# EAGLE design IA + Asserv Shield (EAGLE 9.3.0)
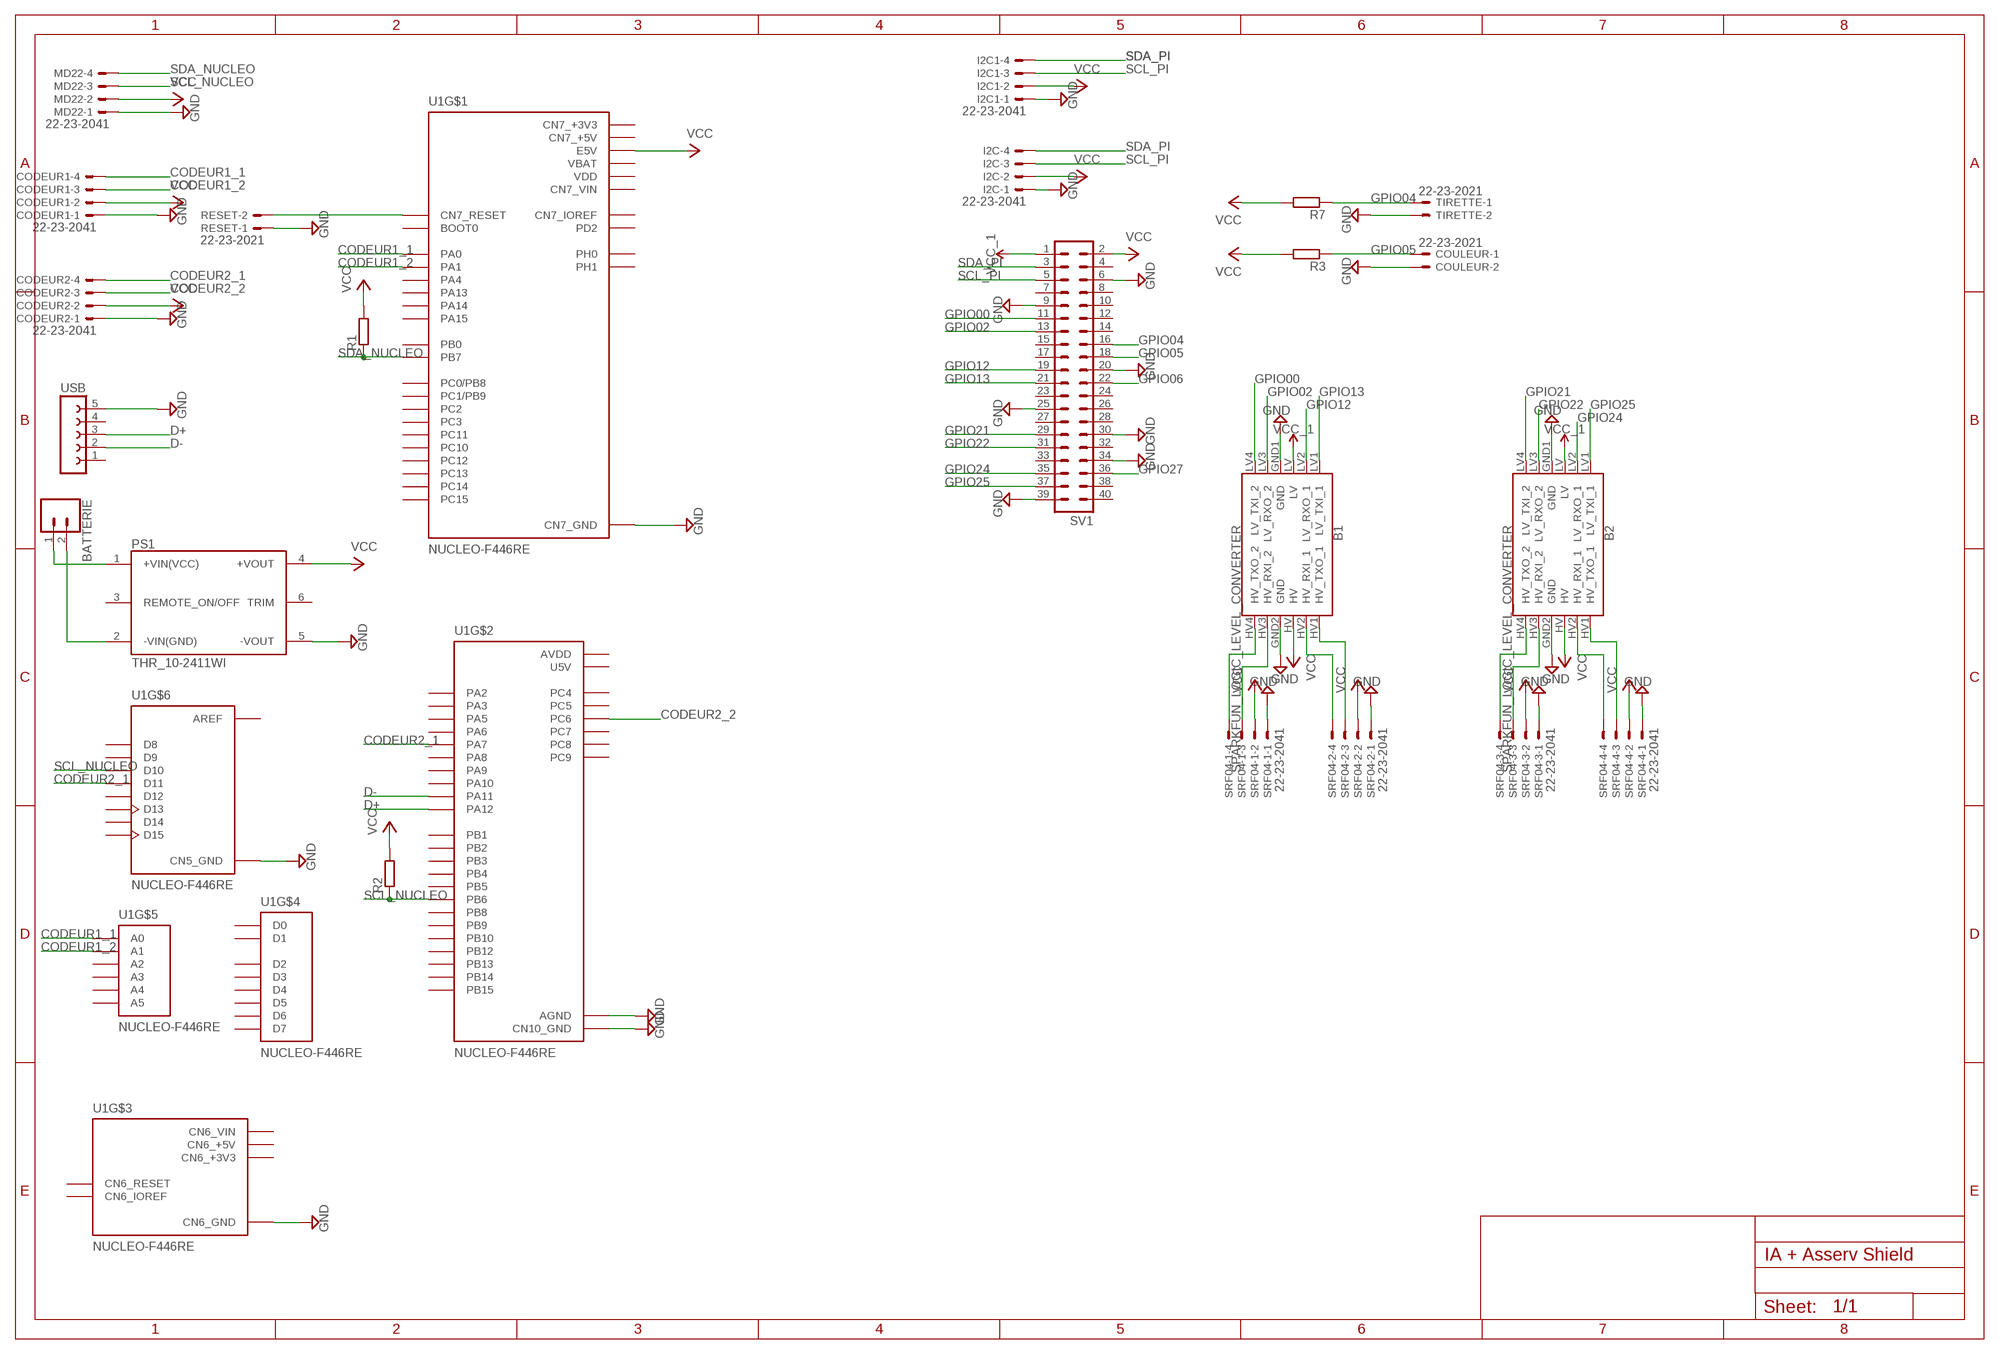
[diagram p0: schematic, sheet 1]

## Parts
B1  SPARKFUN_LOGIC_LEVEL_CONVERTER  [SPARKFUN_LOGIC_LEVEL_CONVERTER]
B2  SPARKFUN_LOGIC_LEVEL_CONVERTER  [SPARKFUN_LOGIC_LEVEL_CONVERTER]
BATTERIE  CONN_02POLAR  [MOLEX-1X2]
CODEUR1  22-23-2041  [22-23-2041]
CODEUR2  22-23-2041  [22-23-2041]
COULEUR  22-23-2021  [22-23-2021]
I2C  22-23-2041  [22-23-2041]
I2C1  22-23-2041  [22-23-2041]
MD22  22-23-2041  [22-23-2041]
PS1  THR_10-2411WI  [CONV_THR_10-2411WI]
R1  R-EU_0204/7  [0204/7]
R2  R-EU_0204/7  [0204/7]
R3  R-EU_0204/7  [0204/7]
R7  R-EU_0204/7  [0204/7]
RESET  22-23-2021  [22-23-2021]
SRF04-1  22-23-2041  [22-23-2041]
SRF04-2  22-23-2041  [22-23-2041]
SRF04-3  22-23-2041  [22-23-2041]
SRF04-4  22-23-2041  [22-23-2041]
SV1  MA20-2  [MA20-2]
TIRETTE  22-23-2021  [22-23-2021]
U1  NUCLEO-F446RE  [MODULE_NUCLEO-F446RE]
USB  FE05-1  [FE05-1]

## Nets
CODEUR1_1: CODEUR1.4 U1.CN7_28(PA0) U1.CN8_1(A0)
CODEUR1_2: CODEUR1.3 U1.CN7_30(PA1) U1.CN8_2(A1)
CODEUR2_1: CODEUR2.4 U1.CN5_4(D11) U1.CN10_15(PA7)
CODEUR2_2: CODEUR2.3 U1.CN10_4(PC6)
D+: U1.CN10_12(PA12) USB.3
D-: U1.CN10_14(PA11) USB.2
GND: B1.GND1(GND) B1.GND2(GND) B2.GND1(GND) B2.GND2(GND) CODEUR1.1 CODEUR2.1 COULEUR.2 I2C1.1 I2C.1 MD22.1 PS1.5(-VOUT) RESET.1 SRF04-1.1 SRF04-2.1 SRF04-3.1 SRF04-4.1 SV1.6 SV1.9 SV1.20 SV1.25 SV1.30 SV1.34 SV1.39 TIRETTE.2 U1.CN5_7(CN5_GND) U1.CN6_6(CN6_GND) U1.CN6_7(CN6_GND) U1.CN7_8(CN7_GND) U1.CN7_19(CN7_GND) U1.CN7_20(CN7_GND) U1.CN7_22(CN7_GND) U1.CN10_9(CN10_GND) U1.CN10_20(CN10_GND) U1.CN10_32(AGND) USB.5
GPIO00: B1.LV4(LV_TXI_2) SV1.11
GPIO02: B1.LV3(LV_RXO_2) SV1.13
GPIO04: R7.1 SV1.16 TIRETTE.1
GPIO05: COULEUR.1 R3.1 SV1.18
GPIO06: SV1.22
GPIO12: B1.LV2(LV_RXO_1) SV1.19
GPIO13: B1.LV1(LV_TXI_1) SV1.21
GPIO21: B2.LV4(LV_TXI_2) SV1.29
GPIO22: B2.LV3(LV_RXO_2) SV1.31
GPIO24: B2.LV2(LV_RXO_1) SV1.35
GPIO25: B2.LV1(LV_TXI_1) SV1.37
GPIO27: SV1.36
N$1: B1.HV2(HV_RXI_1) SRF04-2.4
N$2: BATTERIE.1 PS1.1(+VIN(VCC))
N$3: BATTERIE.2 PS1.2(-VIN(GND))
N$4: RESET.2 U1.CN7_14(CN7_RESET)
N$5: B1.HV1(HV_TXO_1) SRF04-2.3
N$6: B1.HV3(HV_RXI_2) SRF04-1.3
N$7: B1.HV4(HV_TXO_2) SRF04-1.4
N$8: B2.HV2(HV_RXI_1) SRF04-4.4
N$10: B2.HV1(HV_TXO_1) SRF04-4.3
N$11: B2.HV3(HV_RXI_2) SRF04-3.3
N$12: B2.HV4(HV_TXO_2) SRF04-3.4
SCL_NUCLEO: MD22.3 R2.1 U1.CN5_3(D10) U1.CN10_17(PB6)
SCL_PI: I2C1.3 I2C.3 SV1.5
SDA_NUCLEO: MD22.4 R1.1 U1.CN7_21(PB7)
SDA_PI: I2C1.4 I2C.4 SV1.3
VCC: B1.HV B2.HV CODEUR1.2 CODEUR2.2 I2C1.2 I2C.2 MD22.2 PS1.4(+VOUT) R1.2 R2.2 R3.2 R7.2 SRF04-1.2 SRF04-2.2 SRF04-3.2 SRF04-4.2 SV1.2 U1.CN7_6(E5V)
VCC_1: B1.LV B2.LV SV1.1
Unconnected: PS1.3(REMOTE_ON/OFF) PS1.6(TRIM) SV1.4 SV1.7 SV1.8 SV1.10 SV1.12 SV1.14 SV1.15 SV1.17 SV1.23 SV1.24 SV1.26 SV1.27 SV1.28 SV1.32 SV1.33 SV1.38 SV1.40 U1.CN5_1(D8) U1.CN5_2(D9) U1.CN5_5(D12) U1.CN5_6(D13) U1.CN5_9(D14) U1.CN5_10(D15) U1.CN6_2(CN6_IOREF) U1.CN6_3(CN6_RESET) U1.CN7_1(PC10) U1.CN7_2(PC11) U1.CN7_3(PC12) U1.CN7_4(PD2) U1.CN7_7(BOOT0) U1.CN7_12(CN7_IOREF) U1.CN7_13(PA13) U1.CN7_15(PA14) U1.CN7_17(PA15) U1.CN7_23(PC13) U1.CN7_25(PC14) U1.CN7_27(PC15) U1.CN7_29(PH0) U1.CN7_31(PH1) U1.CN7_32(PA4) U1.CN7_34(PB0) U1.CN7_35(PC2) U1.CN7_36(PC1/PB9) U1.CN7_37(PC3) U1.CN7_38(PC0/PB8) U1.CN8_3(A2) U1.CN8_4(A3) U1.CN8_5(A4) U1.CN8_6(A5) U1.CN9_1(D0) U1.CN9_2(D1) U1.CN9_3(D2) U1.CN9_4(D3) U1.CN9_5(D4) U1.CN9_6(D5) U1.CN9_7(D6) U1.CN9_8(D7) U1.CN10_1(PC9) U1.CN10_2(PC8) U1.CN10_3(PB8) U1.CN10_5(PB9) U1.CN10_6(PC5) U1.CN10_11(PA5) U1.CN10_13(PA6) U1.CN10_16(PB12) U1.CN10_19(PC7) U1.CN10_21(PA9) U1.CN10_22(PB2) U1.CN10_23(PA8) U1.CN10_24(PB1) U1.CN10_25(PB10) U1.CN10_26(PB15) U1.CN10_27(PB4) U1.CN10_28(PB14) U1.CN10_29(PB5) U1.CN10_30(PB13) U1.CN10_31(PB3) U1.CN10_33(PA10) U1.CN10_34(PC4) U1.CN10_35(PA2) U1.CN10_37(PA3) USB.1 USB.4

## Power pins joined to a net without a drawn wire
AREF: U1.CN5_8(AREF)
AVDD: U1.CN10_7(AVDD)
CN6_+3V3: U1.CN6_4(CN6_+3V3)
CN6_+5V: U1.CN6_5(CN6_+5V)
CN6_VIN: U1.CN6_8(CN6_VIN)
CN7_+3V3: U1.CN7_16(CN7_+3V3)
CN7_+5V: U1.CN7_18(CN7_+5V)
CN7_VIN: U1.CN7_24(CN7_VIN)
U5V: U1.CN10_8(U5V)
VBAT: U1.CN7_33(VBAT)
VDD: U1.CN7_5(VDD)

## Library data of the parts
B1 B2 = SparkFun-Boards:SPARKFUN_LOGIC_LEVEL_CONVERTER: SparkFun Logic Level Converter -Bi-Directional This is the mechnical outline for the 3.3V - 5V bi directional logic level converter. *Note, the "LOCK" Package has the header pins staggered by an offset of 5 mils (off center line), so that when you slide a row of standard 0.1" headers into the PTH pads, it will hold position vertically. See the follwing turorial for more information on this type of special footprints: Sneaky Footprints <https://www.sparkfun.com/tutorials/114> SparkFun Products: SparkFun Logic Level Converter - Bi-Directional <https://www.sparkfun.com/products/12009>
BATTERIE = SparkFun-Connectors:CONN_02: Multi connection point. Often used as Generic Header-pin footprint for 0.1 inch spaced/style header connections On any of the 0.1 inch spaced packages, you can populate with these: Break Away Headers - Straight <https://www.sparkfun.com/products/116> (PRT-00116) Break Away Male Headers - Right Angle <https://www.sparkfun.com/products/553> (PRT-00553) Female Headers <https://www.sparkfun.com/products/115> (PRT-00115) Break Away Headers - Machine Pin <https://www.sparkfun.com/products/117> (PRT-00117) Break Away Female Headers - Swiss Machine Pin <https://www.sparkfun.com/products/743> (PRT-00743) For SCREWTERMINALS and SPRING TERMINALS visit here: Screw Terimnals on SparkFun.com <https://www.sparkfun.com/search/results?term=Screw+Terminals> (5mm/3.5mm/2.54mm spacing) This device is also useful as a general connection point to wire up your design to another part of your project. Our various solder wires solder well into these plated through hole pads. Hook-Up Wire - Assortment (Stranded, 22 AWG) <https://www.sparkfun.com/products/11375> (PRT-11375) Hook-Up Wire - Assortment (Solid Core, 22 AWG) <https://www.sparkfun.com/products/11367> (PRT-11367) View the entire wire category on our website here <https://www.sparkfun.com/categories/141> Special notes: Molex polarized connector foot print use with: PRT-08233 with associated crimp pins and housings. 2.54_SCREWTERM for use with PRT-10571. 3.5mm Screw Terminal footprints for PRT-08084 5mm Screw Terminal footprints for use with PRT-08432; SF_ID: PRT-09918
CODEUR1 CODEUR2 I2C I2C1 MD22 SRF04-1-SRF04-4 = con-molex:22-23-2041: .100" (2.54mm) Center Header - 4 Pin; MF: MOLEX; MPN: 22-23-2041; OC_FARNELL: 1462920; OC_NEWARK: 38C0355
COULEUR RESET TIRETTE = con-molex:22-23-2021: .100" (2.54mm) Center Header - 2 Pin; MF: MOLEX; MPN: 22-23-2021; OC_FARNELL: 1462926; OC_NEWARK: 25C3832
PS1 = THR_10-2411WI:THR_10-2411WI: 10 Watt DC/DC converter, industrial, 4:1 input, reinforced isolation (3000 VAC), encapsulated, 2"x1" Check availability <https://pricing.snapeda.com/parts/THR%2010-2411WI/Traco%20Power/view-part?ref=eda>; AVAILABILITY: In Stock; DESCRIPTION: 10 Watt DC/DC converter, industrial, 4:1 input, reinforced isolation (3000 VAC), encapsulated, 2x1; MF: Traco Power; MP: THR 10-2411WI; PACKAGE: DIP-6 Traco Power; PRICE: None; PURCHASE-URL: https://pricing.snapeda.com/search/part/THR 10-2411WI/?ref=eda
R1-R3 R7 = rcl:R-EU_: RESISTOR, European symbol; SPICEPREFIX: R
SV1 = con-lstb:MA20-2: PIN HEADER; OC_FARNELL: unknown; OC_NEWARK: unknown
U1 = NUCLEO-F446RE:NUCLEO-F446RE: STM32 Nucleo-64 development board with STM32F446RET6 MCU, supports Arduino and ST morpho connectivity; AVAILABILITY: Unavailable; DESCRIPTION: STM32F446RE, mbed-Enabled Development Nucleo-64 STM32F4 ARM® Cortex®-M4 MCU 32-Bit Embedded Evaluation Board; MF: STMICROELECTRONICS; MP: NUCLEO-F446RE; MPN: NUCLEO-F446RE; OC_FARNELL: 2491978; PACKAGE: None; PRICE: None; SPICEPREFIX: X
USB = con-lsta:FE05-1: FEMALE HEADER; OC_FARNELL: unknown; OC_NEWARK: unknown

## Board
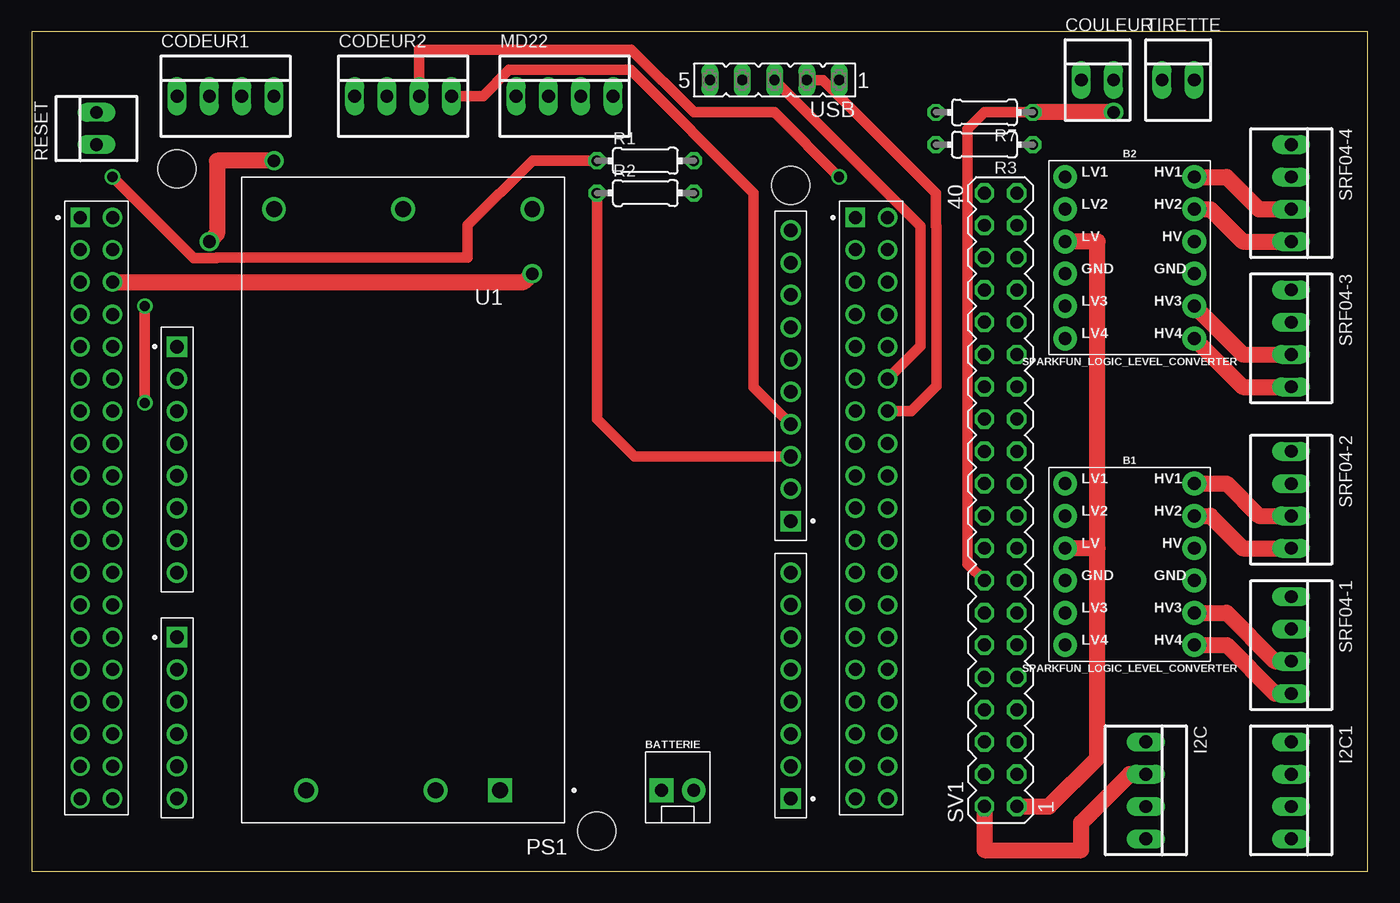
[diagram p1: board, top side]
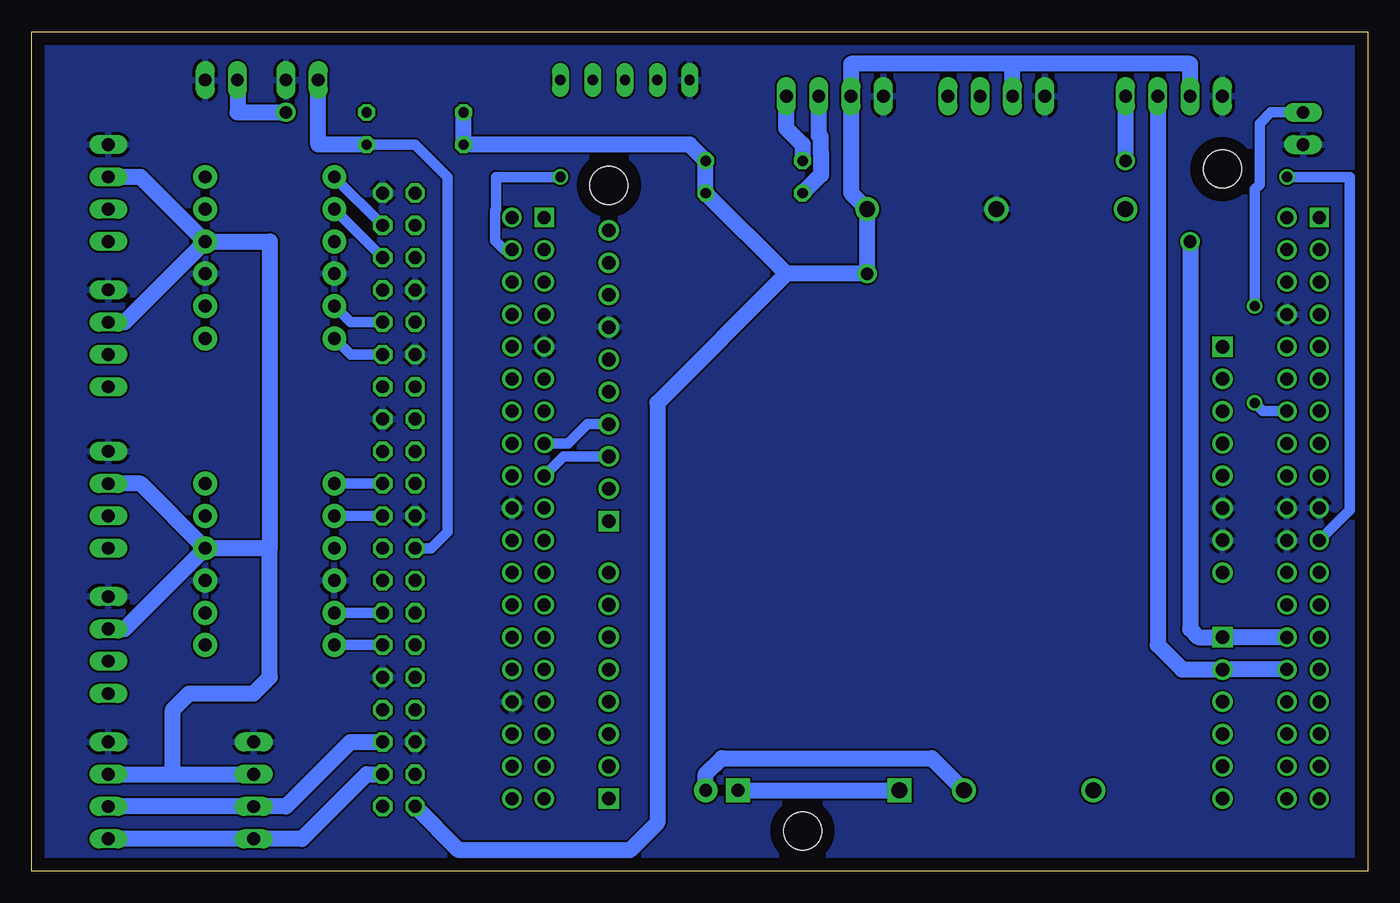
[diagram p2: board, bottom side, seen from below]

Size 105.08 x 66.03 mm. Coordinates in mm from the lower left corner, seen from the top.
Outline: 0,0 105.08,0 105.08,66.03 0,66.03 0,0
Copper layers (1*16): Top 0.035mm / dielectric 1.5mm / Bottom 0.035mm
Design rules "default": minimum track width 6mil, minimum drill 0.35mm, track to track 6mil, track to pad 6mil, pad to pad 6mil, via to via 6mil, smd to smd 6mil, copper to edge 40mil, drill to drill 6mil, minimum pad ring 10mil, minimum via ring 8mil, stop-mask expansion 4mil, vias tented up to drill 0mil, thermal gap 10mil

### Footprints (pad centres in the part's own frame; a part is rotated, then mirrored left to right if it is on the bottom)
SPARKFUN_LOGIC_LEVEL_CONVERTER = drill 1.016 pad 1.88: GND1 -5.08,-1.27; GND2 5.08,-1.27; HV 5.08,1.27; HV1 5.08,6.35; HV2 5.08,3.81; HV3 5.08,-3.81; HV4 5.08,-6.35; LV -5.08,1.27; LV1 -5.08,6.35; LV2 -5.08,3.81; LV3 -5.08,-3.81; LV4 -5.08,-6.35
MOLEX-1X2 = drill 1.016 pad 1.88 square: 1 0,0 | drill 1.016 pad 1.88: 2 2.54,0
22-23-2041 = drill 1 long: 1 -3.81,0; 2 -1.27,0; 3 1.27,0; 4 3.81,0
22-23-2021 = drill 1 long: 1 -1.27,0; 2 1.27,0
CONV_THR_10-2411WI = drill 1.25 square: 1 -7.62,22.86 | drill 1.25: 2 -2.54,22.86; 3 7.62,22.86; 4 -10.16,-22.86; 5 0,-22.86; 6 10.16,-22.86
0204/7 = drill 0.813 octagon: 1 -3.81,0; 2 3.81,0
MA20-2 = drill 1.016 octagon: 1 -24.13,-1.27; 2 -24.13,1.27; 3 -21.59,-1.27; 4 -21.59,1.27; 5 -19.05,-1.27; 6 -19.05,1.27; 7 -16.51,-1.27; 8 -16.51,1.27; 9 -13.97,-1.27; 10 -13.97,1.27; 11 -11.43,-1.27; 12 -11.43,1.27; 13 -8.89,-1.27; 14 -8.89,1.27; 15 -6.35,-1.27; 16 -6.35,1.27; 17 -3.81,-1.27; 18 -3.81,1.27; 19 -1.27,-1.27; 20 -1.27,1.27; 21 1.27,-1.27; 22 1.27,1.27; 23 3.81,-1.27; 24 3.81,1.27; 25 6.35,-1.27; 26 6.35,1.27; 27 8.89,-1.27; 28 8.89,1.27; 29 11.43,-1.27; 30 11.43,1.27; 31 13.97,-1.27; 32 13.97,1.27; 33 16.51,-1.27; 34 16.51,1.27; 35 19.05,-1.27; 36 19.05,1.27; 37 21.59,-1.27; 38 21.59,1.27; 39 24.13,-1.27; 40 24.13,1.27
MODULE_NUCLEO-F446RE = drill 1.07 square: CN5_1 24.13,-14.37; CN6_1 -24.13,-0.65; CN8_1 -24.13,-23.51; CN9_1 24.13,-36.21 | drill 1.07: CN5_2 24.13,-11.83; CN5_3 24.13,-9.29; CN5_4 24.13,-6.75; CN5_5 24.13,-4.21; CN5_6 24.13,-1.67; CN5_7 24.13,0.87; CN5_8 24.13,3.41; CN5_9 24.13,5.95; CN5_10 24.13,8.49; CN6_2 -24.13,-3.19; CN6_3 -24.13,-5.73; CN6_4 -24.13,-8.27; CN6_5 -24.13,-10.81; CN6_6 -24.13,-13.35; CN6_7 -24.13,-15.89; CN6_8 -24.13,-18.43; CN8_2 -24.13,-26.05; CN8_3 -24.13,-28.59; CN8_4 -24.13,-31.13; CN8_5 -24.13,-33.67; CN8_6 -24.13,-36.21; CN9_2 24.13,-33.67; CN9_3 24.13,-31.13; CN9_4 24.13,-28.59; CN9_5 24.13,-26.05; CN9_6 24.13,-23.51; CN9_7 24.13,-20.97; CN9_8 24.13,-18.43 | drill 1.02 square: CN7_1 -31.75,9.51; CN10_1 29.21,9.51 | drill 1.02: CN7_2 -29.21,9.51; CN7_3 -31.75,6.97; CN7_4 -29.21,6.97; CN7_5 -31.75,4.43; CN7_6 -29.21,4.43; CN7_7 -31.75,1.89; CN7_8 -29.21,1.89; CN7_9 -31.75,-0.65; CN7_10 -29.21,-0.65; CN7_11 -31.75,-3.19; CN7_12 -29.21,-3.19; CN7_13 -31.75,-5.73; CN7_14 -29.21,-5.73; CN7_15 -31.75,-8.27; CN7_16 -29.21,-8.27; CN7_17 -31.75,-10.81; CN7_18 -29.21,-10.81; CN7_19 -31.75,-13.35; CN7_20 -29.21,-13.35; CN7_21 -31.75,-15.89; CN7_22 -29.21,-15.89; CN7_23 -31.75,-18.43; CN7_24 -29.21,-18.43; CN7_25 -31.75,-20.97; CN7_26 -29.21,-20.97; CN7_27 -31.75,-23.51; CN7_28 -29.21,-23.51; CN7_29 -31.75,-26.05; CN7_30 -29.21,-26.05; CN7_31 -31.75,-28.59; CN7_32 -29.21,-28.59; CN7_33 -31.75,-31.13; CN7_34 -29.21,-31.13; CN7_35 -31.75,-33.67; CN7_36 -29.21,-33.67; CN7_37 -31.75,-36.21; CN7_38 -29.21,-36.21; CN10_2 31.75,9.51; CN10_3 29.21,6.97; CN10_4 31.75,6.97; CN10_5 29.21,4.43; CN10_6 31.75,4.43; CN10_7 29.21,1.89; CN10_8 31.75,1.89; CN10_9 29.21,-0.65; CN10_10 31.75,-0.65; CN10_11 29.21,-3.19; CN10_12 31.75,-3.19; CN10_13 29.21,-5.73; CN10_14 31.75,-5.73; CN10_15 29.21,-8.27; CN10_16 31.75,-8.27; CN10_17 29.21,-10.81; CN10_18 31.75,-10.81; CN10_19 29.21,-13.35; CN10_20 31.75,-13.35; CN10_21 29.21,-15.89; CN10_22 31.75,-15.89; CN10_23 29.21,-18.43; CN10_24 31.75,-18.43; CN10_25 29.21,-20.97; CN10_26 31.75,-20.97; CN10_27 29.21,-23.51; CN10_28 31.75,-23.51; CN10_29 29.21,-26.05; CN10_30 31.75,-26.05; CN10_31 29.21,-28.59; CN10_32 31.75,-28.59; CN10_33 29.21,-31.13; CN10_34 31.75,-31.13; CN10_35 29.21,-33.67; CN10_36 31.75,-33.67; CN10_37 29.21,-36.21; CN10_38 31.75,-36.21 | hole 3: 8.89,-38.75; 24.13,12.05; -24.13,13.32
FE05-1 = drill 0.813 long: 1 -5.08,0; 2 -2.54,0; 3 0,0; 4 2.54,0; 5 5.08,0

### Placement (x,y rotation side)
B1  86.36,24.13 0 top
B2  86.36,48.26 0 top
BATTERIE  49.53,6.35 0 top
CODEUR1  15.24,60.96 0 top
CODEUR2  29.21,60.96 0 top
COULEUR  83.82,62.23 0 top
I2C  87.63,6.35 270 top
I2C1  99.06,6.35 270 top
MD22  41.91,60.96 0 top
PS1  29.21,29.21 180 top
R1  48.26,55.88 0 top
R2  48.26,53.34 0 top
R3  74.93,57.15 180 top
R7  74.93,59.69 180 top
RESET  5.08,58.42 90 top
SRF04-1  99.06,17.78 270 top
SRF04-2  99.06,29.21 270 top
SRF04-3  99.06,41.91 270 top
SRF04-4  99.06,53.34 270 top
SV1  76.2,29.21 90 top
TIRETTE  90.17,62.23 0 top
U1  35.56,41.91 0 top
USB  58.42,62.23 180 top

### Tracks (layer width: path | path; a pad name or v marks a point on that pad's centre or on a via)
CODEUR1_1  (via drill 1)
  Top 1.27: v19.05,55.88 14.58,55.88 14.58,50.14 v13.97,49.53
  Bottom 1.27: U1.CN7_28 U1.CN8_1 13.32,18.4 13.97,19.05 v13.97,49.53 | CODEUR1.4 v19.05,55.88
CODEUR1_2
  Bottom 1.27: U1.CN7_30 U1.CN8_2 14.59,15.86 16.51,17.78 CODEUR1.3
CODEUR2_1
  Top 0.813: CODEUR2.4 35.49,60.96 37.56,63.03 47.08,63.03 56.77,53.34 56.77,38.08 U1.CN5_4
  Bottom 0.813: U1.CN10_15 62.88,33.64 61.36,35.16 U1.CN5_4
CODEUR2_2  (via drill 0.8)
  Top 0.813: v63.5,54.61 58.42,59.69 52.07,59.69 47.15,64.61 30.48,64.61 CODEUR2.3
  Bottom 0.813: U1.CN10_4 67.93,48.88 68.63,49.58 68.63,51.97 68.58,52.02 68.58,54.61 v63.5,54.61
D+
  Top 0.813: U1.CN10_12 69.9,41.31 69.9,50.75 USB.3
D-
  Top 0.813: U1.CN10_14 69.2,36.18 71.17,38.15 71.17,50.7 71.12,50.75 71.12,53.34 62.23,62.23 USB.2
GND
  pour Bottom: 0,66.04 105.41,66.04 105.41,0 0,0
GPIO00
  Bottom 0.813: SV1.11 B1.LV4
GPIO02
  Bottom 0.813: SV1.13 B1.LV3
GPIO04  (via drill 1)
  Top 0.813: R7.1 74.93,59.69 73.61,58.37 73.61,24.18 SV1.16
  Top 1.27: v85.09,59.69 R7.1
  Bottom 1.27: TIRETTE.1 88.9,59.69 v85.09,59.69
GPIO05
  Bottom 0.813: R3.1 74.93,57.15 72.39,54.61 72.39,26.67 73.66,25.4 SV1.18
  Bottom 1.27: R3.1 82.55,57.15 COULEUR.1
GPIO12
  Bottom 0.813: SV1.19 B1.LV2
GPIO13
  Bottom 0.813: SV1.21 B1.LV1
GPIO21
  Bottom 0.813: SV1.29 80.01,40.64 B2.LV4
GPIO22
  Bottom 0.813: SV1.31 80.01,43.18 B2.LV3
GPIO24
  Bottom 0.813: SV1.35 B2.LV2
GPIO25
  Bottom 0.813: SV1.37 B2.LV1
N$1
  Top 1.27: B1.HV2 92.71,27.94 95.25,25.4 SRF04-2.4
N$2
  Bottom 1.27: BATTERIE.1 PS1.1
N$3
  Bottom 1.27: BATTERIE.2 52.07,7.62 50.8,8.89 34.29,8.89 PS1.2
N$4  (via drill 0.8)
  Top 0.813: v8.89,36.83 v8.89,44.45
  Bottom 0.813: U1.CN7_14 8.24,36.18 v8.89,36.83 | v8.89,44.45 8.89,53.64 8.51,54.02 8.51,58.8 7.62,59.69 RESET.2
N$5
  Top 1.27: B1.HV1 93.98,30.48 96.52,27.94 SRF04-2.3
N$6
  Top 1.27: B1.HV3 93.98,20.32 97.79,16.51 SRF04-1.3
N$7
  Top 1.27: B1.HV4 93.98,17.78 97.79,13.97 SRF04-1.4
N$8
  Top 1.27: B2.HV2 92.71,52.07 95.25,49.53 SRF04-4.4
N$10
  Top 1.27: B2.HV1 93.98,54.61 96.52,52.07 SRF04-4.3
N$11
  Top 1.27: B2.HV3 95.25,40.64 SRF04-3.3
N$12
  Top 1.27: B2.HV4 95.25,38.1 SRF04-3.4
SCL_NUCLEO
  Top 0.813: R2.1 44.45,35.56 47.39,32.62 U1.CN5_3
  Bottom 0.813: U1.CN10_17 63.25,32.62 U1.CN5_3
  Bottom 1.27: R2.1 43,54.79 43,56.48 43.03,56.5 43.03,57.74 43.18,57.89 MD22.3
SCL_PI
  Bottom 1.27: SV1.5 80.01,10.16 85.09,5.08 I2C.3 I2C1.3
SDA_NUCLEO  (via drill 0.8)
  Top 0.813: v6.35,54.61 12.74,48.22 14.51,48.22 14.55,48.26 34.29,48.26 34.29,50.8 39.37,55.88 R1.1
  Bottom 0.813: U1.CN7_21 1.42,28.41 1.42,54.61 v6.35,54.61
  Bottom 1.27: R1.1 44.45,57.15 45.72,58.42 MD22.4
SDA_PI
  Bottom 1.27: SV1.3 78.74,7.62 83.82,2.54 I2C.4 I2C1.4
VCC  (via drill 1)
  Top 1.27: U1.CN7_6 38.72,46.34 v39.37,46.99 | SV1.2 74.93,1.65 82.55,1.65 82.55,3.81 86.36,7.62 I2C.2
  Bottom 1.27: R7.2 R3.2 53.34,57.15 R1.2 R2.2 45.72,46.99 | B2.HV 97.79,43.18 SRF04-3.2 | B2.HV 96.52,54.61 SRF04-4.2 | B1.HV 97.79,19.05 SRF04-1.2 | B1.HV 96.52,30.48 SRF04-2.2 | I2C1.2 93.98,7.62 | 93.98,7.62 I2C.2 | 27.94,63.5 13.97,63.5 CODEUR1.2 | 27.94,63.5 40.64,63.5 MD22.2 40.64,53.34 PS1.4 v39.37,46.99 45.72,46.99 | B2.HV 86.36,49.53 86.36,25.4 | 86.36,25.4 B1.HV | 93.98,7.62 93.98,12.7 92.71,13.97 87.63,13.97 86.36,15.24 86.36,25.4 | SV1.2 71.5,1.65 58.04,1.65 55.88,3.81 55.88,36.83 45.72,46.99 | CODEUR2.2 27.94,63.5
VCC_1
  Top 1.27: SV1.1 80.01,5.08 83.82,8.89 83.82,25.4 | 83.82,25.4 B1.LV | 83.82,25.4 83.82,49.53 B2.LV